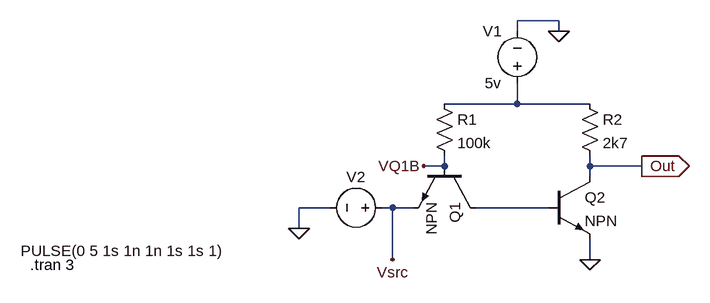
[diagram p0: schematic electronics_bjt_inverting_buffer.asc]
electronics_bjt_inverting_buffer.asc, the LTspice schematic file:
Version 4
SHEET 1 880 680
WIRE 272 -64 208 -64
WIRE 208 -48 208 -64
WIRE 272 -48 272 -64
WIRE 208 64 208 32
WIRE 208 64 96 64
WIRE 320 64 208 64
WIRE 96 160 96 144
WIRE 96 160 64 160
WIRE 320 160 320 144
WIRE 400 160 320 160
WIRE 320 176 320 160
WIRE -80 224 -128 224
WIRE 16 224 0 224
WIRE 48 224 16 224
WIRE 256 224 144 224
WIRE -128 256 -128 224
WIRE 16 304 16 224
WIRE 320 304 320 272
FLAG 320 304 0
FLAG 400 160 Out
IOPIN 400 160 Out
FLAG 272 -48 0
FLAG -128 256 0
FLAG 16 304 Vsrc
FLAG 64 160 VQ1B
SYMBOL npn 144 160 R90
SYMATTR InstName Q1
SYMBOL npn 256 176 R0
SYMATTR InstName Q2
SYMBOL voltage 208 48 R180
WINDOW 0 24 96 Left 2
WINDOW 3 24 16 Left 2
WINDOW 123 0 0 Left 0
WINDOW 39 0 0 Left 0
SYMATTR InstName V1
SYMATTR Value 5v
SYMBOL res 80 48 R0
SYMATTR InstName R1
SYMATTR Value 100k
SYMBOL res 304 48 R0
SYMATTR InstName R2
SYMATTR Value 2k7
SYMBOL voltage 16 224 R90
WINDOW 0 -32 56 VBottom 2
WINDOW 3 51 416 VTop 2
WINDOW 123 0 0 Left 0
WINDOW 39 0 0 Left 0
SYMATTR InstName V2
SYMATTR Value PULSE(0 5 1s 1n 1n 1s 1s 1)
TEXT -542 312 Left 2 !.tran 3

The netlist it stands for:
* electronics_bjt_inverting_buffer.asc
Q1 N002 VQ1B Vsrc 0 NPN
Q2 Out N002 0 0 NPN
V1 N001 0 5v
R1 N001 VQ1B 100k
R2 N001 Out 2k7
V2 Vsrc 0 PULSE(0 5 1s 1n 1n 1s 1s 1)
.model NPN NPN
.model PNP PNP
.lib standard.bjt
.tran 3
.backanno
.end